# EAGLE design Relay8WatchdogShield (EAGLE 9.5.0)
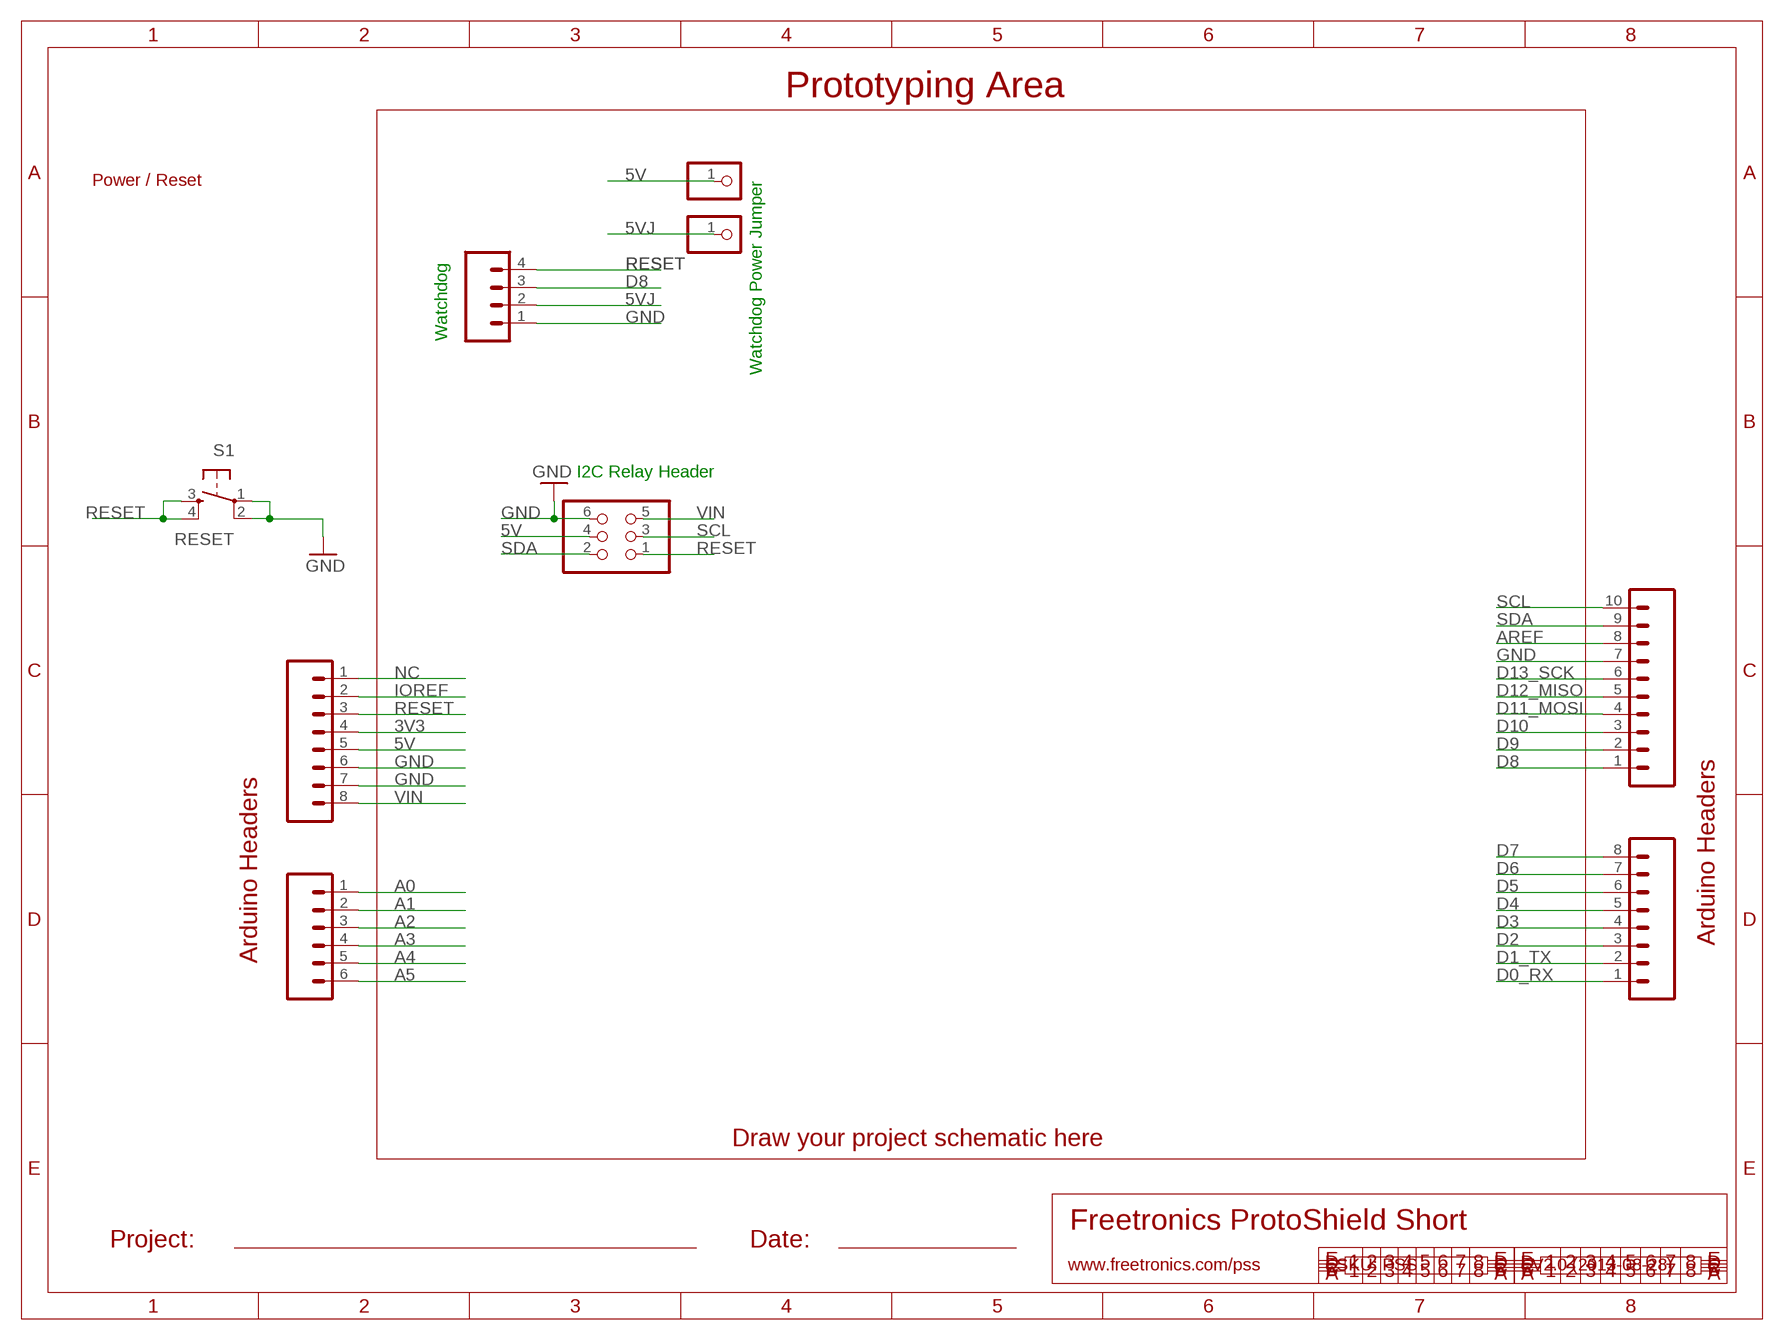
[diagram p0: schematic, sheet 1]

## Parts
J1  Digital_0_7  M08  [1X08]
J2  Analog  M06SIP  [1X06]
J3  Digital_8_13  M100.1  [1X10]
JP1  PINHD-1X1  [1X01]
JP2  PINHD-1X1  [1X01]
JP3  FREETRONICS-MASTER-V1_M04PTH  [FREETRONICS-MASTER-V1_1X04]
JP4  PINHD-2X3  [2X03]
POWER  Power  M08  [1X08]
S1  RESET  TAC_SWITCHPTH  [TACTILE-PTH]

## Nets
3V3: POWER.4
5V: JP1.1 JP4.4 POWER.5
5VJ: JP2.1 JP3.2
A0: J2.1
A1: J2.2
A2: J2.3
A3: J2.4
A4: J2.5
A5: J2.6
AREF: J3.8
D0_RX: J1.1
D1_TX: J1.2
D2: J1.3
D3: J1.4
D4: J1.5
D5: J1.6
D6: J1.7
D7: J1.8
D8: J3.1 JP3.3
D9: J3.2
D10: J3.3
D11_MOSI: J3.4
D12_MISO: J3.5
D13_SCK: J3.6
GND: J3.7 JP3.1 JP4.6 POWER.6 POWER.7 S1.1 S1.2
IOREF: POWER.2
NC: POWER.1
RESET: JP3.4 JP4.1 POWER.3 S1.3 S1.4
SCL: J3.10 JP4.3
SDA: J3.9 JP4.2
VIN: JP4.5 POWER.8

## Notes on the sheet
- Prototyping Area
- Watchdog Power Jumper
- Power / Reset
- Watchdog
- I2C Relay Header
- Arduino Headers
- Arduino Headers
- Draw your project schematic here
- Freetronics ProtoShield Short
- Project: | Date:
- www.freetronics.com/pss | SKU: PSS | V2.0 (2013-08-28)

## Library data of the parts
J1 POWER = freetronics:M08: Header 8 Standard 8-pin 0.1" header. Use with straight break away headers (SKU : PRT-00116), right angle break away headers (PRT-00553), swiss pins (PRT-00743), machine pins (PRT-00117), and female headers (PRT-00115).
J2 = freetronics:M06: Header 6 Standard 6-pin 0.1" header. Use with straight break away headers (SKU : PRT-00116), right angle break away headers (PRT-00553), swiss pins (PRT-00743), machine pins (PRT-00117), and female headers (PRT-00115). Molex polarized connector foot print use with SKU : PRT-08094 with associated crimp pins and housings. NOTES ON THE VARIANTS LOCK and LOCK_LONGPADS... This footprint was designed to help hold the alignment of a through-hole component (i.e. 6-pin header) while soldering it into place. You may notice that each hole has been shifted either up or down by 0.005 of an inch from it's more standard position (which is a perfectly straight line). This slight alteration caused the pins (the squares in the middle) to touch the edges of the holes. Because they are alternating, it causes a "brace" to hold the component in place. 0.005 has proven to be the perfect amount of "off-center" position when using our standard breakaway headers. Although looks a little odd when you look at the bare footprint, once you have a header in there, the alteration is very hard to notice. Also, if you push a header all the way into place, it is covered up entirely on the bottom side. This idea of altering the position of holes to aid alignment will be further integrated into the Sparkfun Library for other footprints. It can help hold any component with 3 or more connection pins.
J3 = freetronics-original:M10: Header 10 Standard 10-pin 0.1" header. Use with straight break away headers (SKU : PRT-00116), right angle break away headers (PRT-00553), swiss pins (PRT-00743), machine pins (PRT-00117), and female headers (PRT-00115).
JP1 JP2 = adafruit:PINHD-1X1: Pin header 1x1 for 0.1" spacing With round pins
JP3 = EtherMegaR3:FREETRONICS-MASTER-V1_M04: Header 4 Standard 4-pin 0.1" header. Use with straight break away headers (SKU : PRT-00116), right angle break away headers (PRT-00553), swiss pins (PRT-00743), machine pins (PRT-00117), and female headers (PRT-00115). Molex polarized connector foot print use with SKU : PRT-08231 with associated crimp pins and housings.
JP4 = pinhead:PINHD-2X3: PIN HEADER
S1 = freetronics:TAC_SWITCH: Momentary Switch Button commonly used for reset or general input. Spark Fun Electronics SKU : COM-00097

## Board
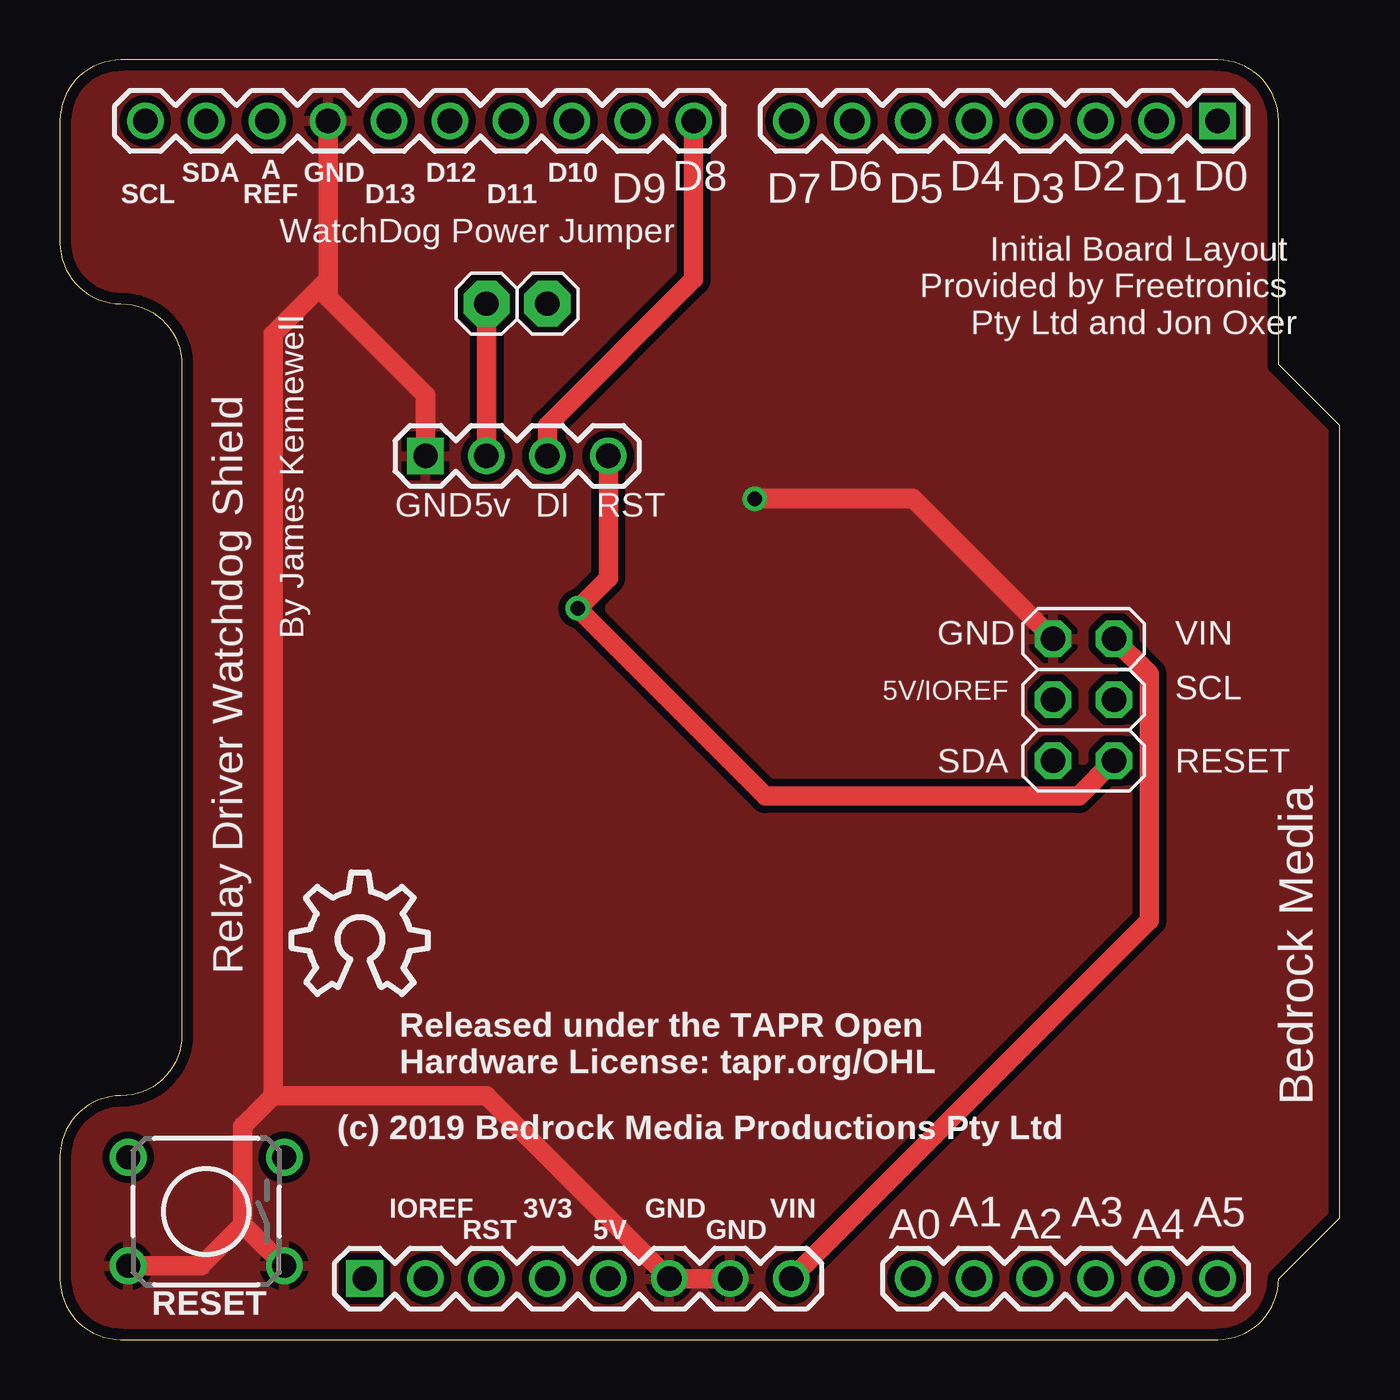
[diagram p1: board, top side]
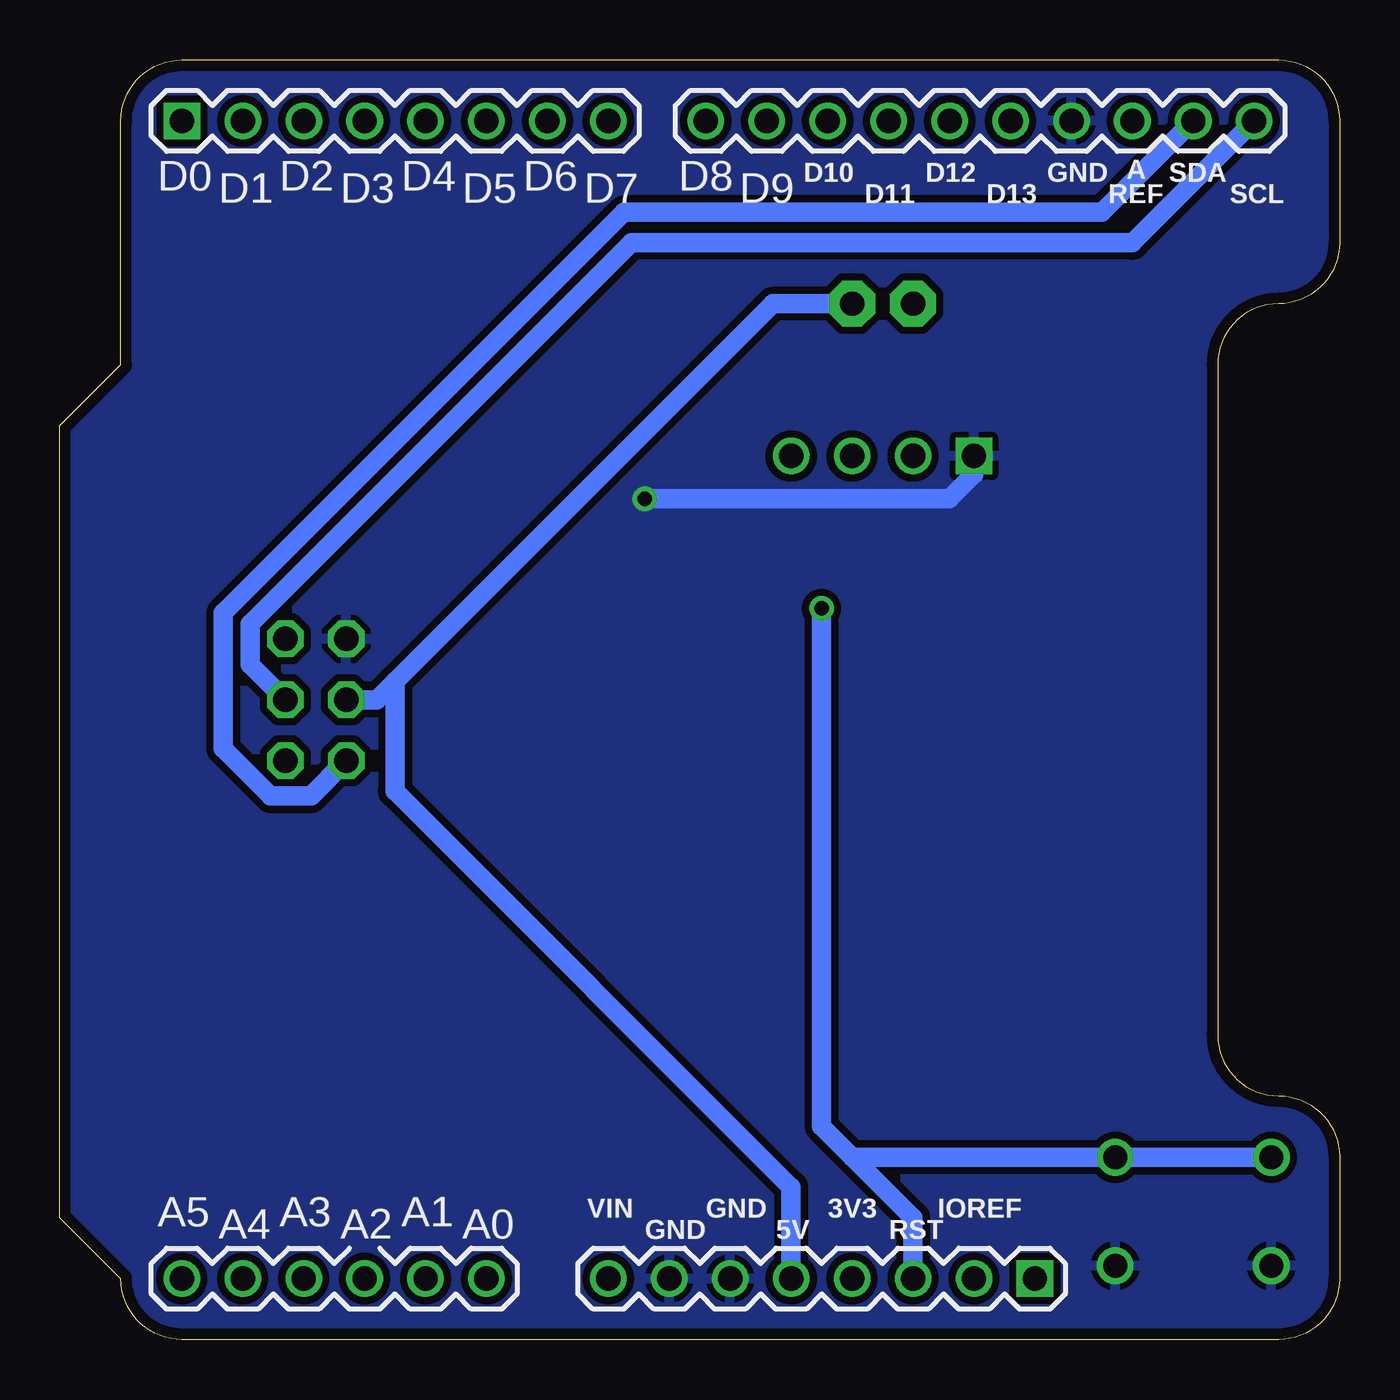
[diagram p2: board, bottom side, seen from below]

Size 53.34 x 53.34 mm. Coordinates in mm from the lower left corner, seen from the top.
Outline: 0,2.54 arc90 2.54,0 48.26,0 arc90 50.8,2.54 53.34,5.08 53.34,38.1 50.8,40.64 50.8,50.8 arc90 48.26,53.34 2.54,53.34 arc90 0,50.8 0,45.72 arc90 2.54,43.18 arc-90 5.08,40.64 5.08,12.7 arc-90 2.54,10.16 arc90 0,7.62 0,2.54
Copper layers (1*16): Top 0.035mm / dielectric 1.5mm / Bottom 0.035mm
Design rules "default *": minimum track width 10mil, minimum drill 24mil, track to track 12mil, track to pad 12mil, pad to pad 12mil, via to via 12mil, smd to smd 8mil, copper to edge 18mil, drill to drill 8mil, minimum pad ring 10mil, minimum via ring 8mil, stop-mask expansion 4mil, vias tented up to drill 0mil, thermal gap 10mil

### Footprints (pad centres in the part's own frame; a part is rotated, then mirrored left to right if it is on the bottom)
1X08 = drill 1.016 square: 1 0,0 | drill 1.016: 2 2.54,0; 3 5.08,0; 4 7.62,0; 5 10.16,0; 6 12.7,0; 7 15.24,0; 8 17.78,0
1X06 = drill 1.016: 1 0,0; 2 2.54,0; 3 5.08,0; 4 7.62,0; 5 10.16,0; 6 12.7,0
1X10 = drill 1.016: 1 0,0; 2 2.54,0; 3 5.08,0; 4 7.62,0; 5 10.16,0; 6 12.7,0; 7 15.24,0; 8 17.78,0; 9 20.32,0; 10 22.86,0
1X01 = drill 1.016 pad 1.93 octagon: 1 0,0
FREETRONICS-MASTER-V1_1X04 = drill 1.016 square: 1 0,0 | drill 1.016: 2 2.54,0; 3 5.08,0; 4 7.62,0
2X03 = drill 1.016 octagon: 1 -2.54,-1.27; 2 -2.54,1.27; 3 0,-1.27; 4 0,1.27; 5 2.54,-1.27; 6 2.54,1.27
TACTILE-PTH = drill 1.016: 1 -3.251,2.261; 2 3.251,2.261; 3 -3.251,-2.261; 4 3.251,-2.261

### Placement (x,y rotation side)
J1  48.26,50.8 180 top
J2  35.56,2.54 0 top
J3  26.42,50.8 180 top
JP1  20.32,43.18 270 top
JP2  17.78,43.18 270 top
JP3  15.24,36.83 0 top
JP4  42.67,26.67 90 top
POWER  12.7,2.54 0 top
S1  6.1,5.33 180 top
U$1  [OSHW_10X200_NOTEXT]  9.66,14.4 0 top

### Tracks (layer width: path | path; a pad name or v marks a point on that pad's centre or on a via)
5V
  Bottom 0.813: POWER.5 22.86,6.35 39.37,22.86 39.37,27.43 | JP4.4 40.13,26.67 39.37,27.43 | JP1.1 23.62,43.18 39.37,27.43
5VJ
  Top 0.813: JP2.1 JP3.2
D8
  Top 0.813: JP3.3 20.32,38.1 26.42,44.2 J3.1
GND  (via drill 0.61)
  Top 0.813: 7.62,4.8 S1.1 | 7.62,4.8 5.89,3.07 S1.2 | POWER.7 POWER.6 17.78,10.16 8.89,10.16 | J3.7 11.18,44.2 | 11.18,44.2 11.18,43.43 15.24,39.37 JP3.1 | 11.18,44.2 8.89,41.91 8.89,10.16 | 7.62,4.8 7.62,8.89 8.89,10.16 | v28.96,35.05 35.56,35.05 JP4.6
  Bottom 0.813: JP3.1 15.24,36.07 16.26,35.05 v28.96,35.05
  pour Bottom: 0,50.8 arc-74 2.54,53.34 48.26,53.34 arc-74 50.8,50.8 50.8,40.64 53.34,38.1 53.34,5.08 50.8,2.54 arc-74 48.26,0 2.54,0 arc-74 0,2.54 0,7.62 arc-90 2.54,10.16 arc90 5.08,12.7 5.08,40.64 arc90 2.54,43.18 arc-90 0,45.72
  pour Top: 0,50.8 arc-74 2.54,53.34 48.26,53.34 arc-74 50.8,50.8 50.8,40.64 53.34,38.1 53.34,5.08 50.8,2.54 arc-74 48.26,0 2.54,0 arc-74 0,2.54 0,7.62 arc-90 2.54,10.16 arc90 5.08,12.7 5.08,40.64 arc90 2.54,43.18 arc-90 0,45.72
RESET  (via drill 0.61)
  Top 0.813: JP3.4 22.86,31.75 v21.59,30.48 29.41,22.66 42.47,22.66 JP4.1
  Bottom 0.813: v21.59,30.48 21.59,8.89 20.3,7.59 | 20.3,7.59 S1.3 S1.4 | POWER.3 17.78,5.08 20.3,7.59
SCL
  Bottom 0.813: JP4.3 45.41,28.14 45.41,29.82 29.52,45.72 8.64,45.72 J3.10
SDA
  Bottom 0.813: J3.9 9.91,46.99 29.83,46.99 46.53,30.28 46.53,24.64 44.55,22.66 42.88,22.66 JP4.2
VIN
  Top 0.813: JP4.5 45.41,27.74 45.41,17.48 POWER.8

### Text on the board
tPlace: SDA | A | GND | D12 | D10 | D8 | D6 | D4 | D2 | D0 | SCL | REF | D13 | D11 | D9 | D7 | D5 | D3 | D1 | WatchDog Power Jumper | Initial Board Layout / Provided by Freetronics / Pty Ltd and Jon Oxer | GND | 5v | DI | RST | By James Kennewell | GND | VIN | 5V/IOREF | SCL | SDA | RESET | Bedrock Media | Relay Driver Watchdog Shield | Released under the TAPR Open / Hardware License: tapr.org/OHL | (c) 2019 Bedrock Media Productions Pty Ltd | IOREF | 3V3 | GND | VIN | A1 | A3 | A5 | RST | 5V | GND | A0 | A2 | A4 | RESET
bPlace: SDA | A | GND | D12 | D10 | D8 | D6 | D4 | D2 | D0 | SCL | REF | D13 | D11 | D9 | D7 | D5 | D3 | D1 | IOREF | 3V3 | GND | VIN | A1 | A3 | A5 | RST | 5V | GND | A0 | A2 | A4